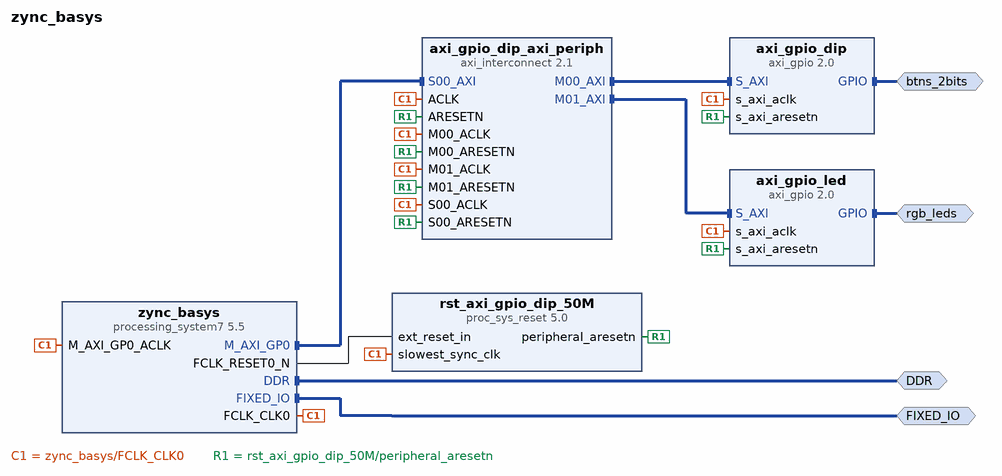
[diagram p0: block diagram of the top level]
# Vivado block design zync_basys, xc7z007sclg400-1, Vivado 2023.2
create_bd_design zync_basys

create_bd_intf_port -mode Master -vlnv xilinx.com:interface:ddrx_rtl:1.0 DDR
create_bd_intf_port -mode Master -vlnv xilinx.com:display_processing_system7:fixedio_rtl:1.0 FIXED_IO
create_bd_intf_port -mode Master -vlnv xilinx.com:interface:gpio_rtl:1.0 btns_2bits
create_bd_intf_port -mode Master -vlnv xilinx.com:interface:gpio_rtl:1.0 rgb_leds

create_bd_cell -type ip -vlnv xilinx.com:ip:processing_system7:5.5 zync_basys
set_property -dict [list \
  CONFIG.PCW_APU_PERIPHERAL_FREQMHZ 650 \
  CONFIG.PCW_CRYSTAL_PERIPHERAL_FREQMHZ 50 \
  CONFIG.PCW_ENET0_PERIPHERAL_ENABLE 0 \
  CONFIG.PCW_ENET0_RESET_ENABLE 1 \
  CONFIG.PCW_ENET0_RESET_IO {MIO 9} \
  CONFIG.PCW_ENET_RESET_ENABLE 1 \
  CONFIG.PCW_GPIO_MIO_GPIO_ENABLE 1 \
  CONFIG.PCW_GPIO_MIO_GPIO_IO MIO \
  CONFIG.PCW_I2C_RESET_ENABLE 1 \
  CONFIG.PCW_PRESET_BANK1_VOLTAGE {LVCMOS 1.8V} \
  CONFIG.PCW_QSPI_PERIPHERAL_ENABLE 0 \
  CONFIG.PCW_SD0_GRP_CD_ENABLE 1 \
  CONFIG.PCW_SD0_GRP_CD_IO {MIO 47} \
  CONFIG.PCW_SD0_GRP_WP_ENABLE 0 \
  CONFIG.PCW_SD0_PERIPHERAL_ENABLE 1 \
  CONFIG.PCW_SD0_SD0_IO {MIO 40 .. 45} \
  CONFIG.PCW_SDIO_PERIPHERAL_FREQMHZ 100 \
  CONFIG.PCW_UART0_PERIPHERAL_ENABLE 1 \
  CONFIG.PCW_UART0_UART0_IO {MIO 14 .. 15} \
  CONFIG.PCW_UART_PERIPHERAL_FREQMHZ 100 \
  CONFIG.PCW_UIPARAM_DDR_BUS_WIDTH {16 Bit} \
  CONFIG.PCW_UIPARAM_DDR_FREQ_MHZ 525 \
  CONFIG.PCW_UIPARAM_DDR_PARTNO {MT41K256M16 RE-125} \
  CONFIG.PCW_USB0_PERIPHERAL_ENABLE 0 \
  CONFIG.PCW_USB0_RESET_ENABLE 1 \
  CONFIG.PCW_USB0_RESET_IO {MIO 46} \
  CONFIG.PCW_USB_RESET_ENABLE 1 \
] [get_bd_cells zync_basys]
# 291 more settings of zync_basys are not shown: defaults, MIO pin electricals, DDR timing, and values the tool derives
create_bd_cell -type ip -vlnv xilinx.com:ip:axi_gpio:2.0 axi_gpio_dip
set_property -dict {CONFIG.GPIO_BOARD_INTERFACE btns_2bits CONFIG.USE_BOARD_FLOW true} [get_bd_cells axi_gpio_dip]
create_bd_cell -type ip -vlnv xilinx.com:ip:axi_interconnect:2.1 axi_gpio_dip_axi_periph
set_property -dict {CONFIG.NUM_MI 2} [get_bd_cells axi_gpio_dip_axi_periph]
create_bd_cell -type ip -vlnv xilinx.com:ip:proc_sys_reset:5.0 rst_axi_gpio_dip_50M
create_bd_cell -type ip -vlnv xilinx.com:ip:axi_gpio:2.0 axi_gpio_led
set_property -dict {CONFIG.GPIO_BOARD_INTERFACE rgb_leds CONFIG.USE_BOARD_FLOW true} [get_bd_cells axi_gpio_led]

# ---- connections ----

connect_bd_intf_net -intf_net axi_gpio_0_GPIO [get_bd_intf_ports btns_2bits] [get_bd_intf_pins axi_gpio_dip/GPIO]
connect_bd_intf_net -intf_net axi_gpio_dip_M_AXI_GP0 [get_bd_intf_pins zync_basys/M_AXI_GP0] [get_bd_intf_pins axi_gpio_dip_axi_periph/S00_AXI]
connect_bd_intf_net [get_bd_intf_pins axi_gpio_dip_axi_periph/M00_AXI] [get_bd_intf_pins axi_gpio_dip/S_AXI]
connect_bd_intf_net [get_bd_intf_pins axi_gpio_dip_axi_periph/M01_AXI] [get_bd_intf_pins axi_gpio_led/S_AXI]
connect_bd_intf_net [get_bd_intf_ports rgb_leds] [get_bd_intf_pins axi_gpio_led/GPIO]
connect_bd_intf_net -intf_net processing_system7_0_DDR [get_bd_intf_ports DDR] [get_bd_intf_pins zync_basys/DDR]
connect_bd_intf_net -intf_net processing_system7_0_FIXED_IO [get_bd_intf_ports FIXED_IO] [get_bd_intf_pins zync_basys/FIXED_IO]
connect_bd_net -net axi_gpio_dip_FCLK_CLK0 [get_bd_pins zync_basys/FCLK_CLK0] \
  [get_bd_pins zync_basys/M_AXI_GP0_ACLK] [get_bd_pins axi_gpio_dip_axi_periph/S00_ACLK] \
  [get_bd_pins rst_axi_gpio_dip_50M/slowest_sync_clk] [get_bd_pins axi_gpio_dip/s_axi_aclk] \
  [get_bd_pins axi_gpio_dip_axi_periph/M00_ACLK] [get_bd_pins axi_gpio_dip_axi_periph/ACLK] \
  [get_bd_pins axi_gpio_led/s_axi_aclk] [get_bd_pins axi_gpio_dip_axi_periph/M01_ACLK]
connect_bd_net -net axi_gpio_dip_FCLK_RESET0_N [get_bd_pins zync_basys/FCLK_RESET0_N] [get_bd_pins rst_axi_gpio_dip_50M/ext_reset_in]
connect_bd_net [get_bd_pins rst_axi_gpio_dip_50M/peripheral_aresetn] \
  [get_bd_pins axi_gpio_dip_axi_periph/S00_ARESETN] [get_bd_pins axi_gpio_dip/s_axi_aresetn] \
  [get_bd_pins axi_gpio_dip_axi_periph/M00_ARESETN] [get_bd_pins axi_gpio_dip_axi_periph/ARESETN] \
  [get_bd_pins axi_gpio_led/s_axi_aresetn] [get_bd_pins axi_gpio_dip_axi_periph/M01_ARESETN]

# ---- address map ----
assign_bd_address -offset 0x41200000 -range 64K -target_address_space [get_bd_addr_spaces zync_basys/Data] [get_bd_addr_segs axi_gpio_dip/S_AXI/Reg]
assign_bd_address -offset 0x41210000 -range 64K -target_address_space [get_bd_addr_spaces zync_basys/Data] [get_bd_addr_segs axi_gpio_led/S_AXI/Reg]

validate_bd_design
save_bd_design
